# Altium schematic sheet MOSFET.SchDoc
size A4; SheetNumber: 5; SheetTotal: 7
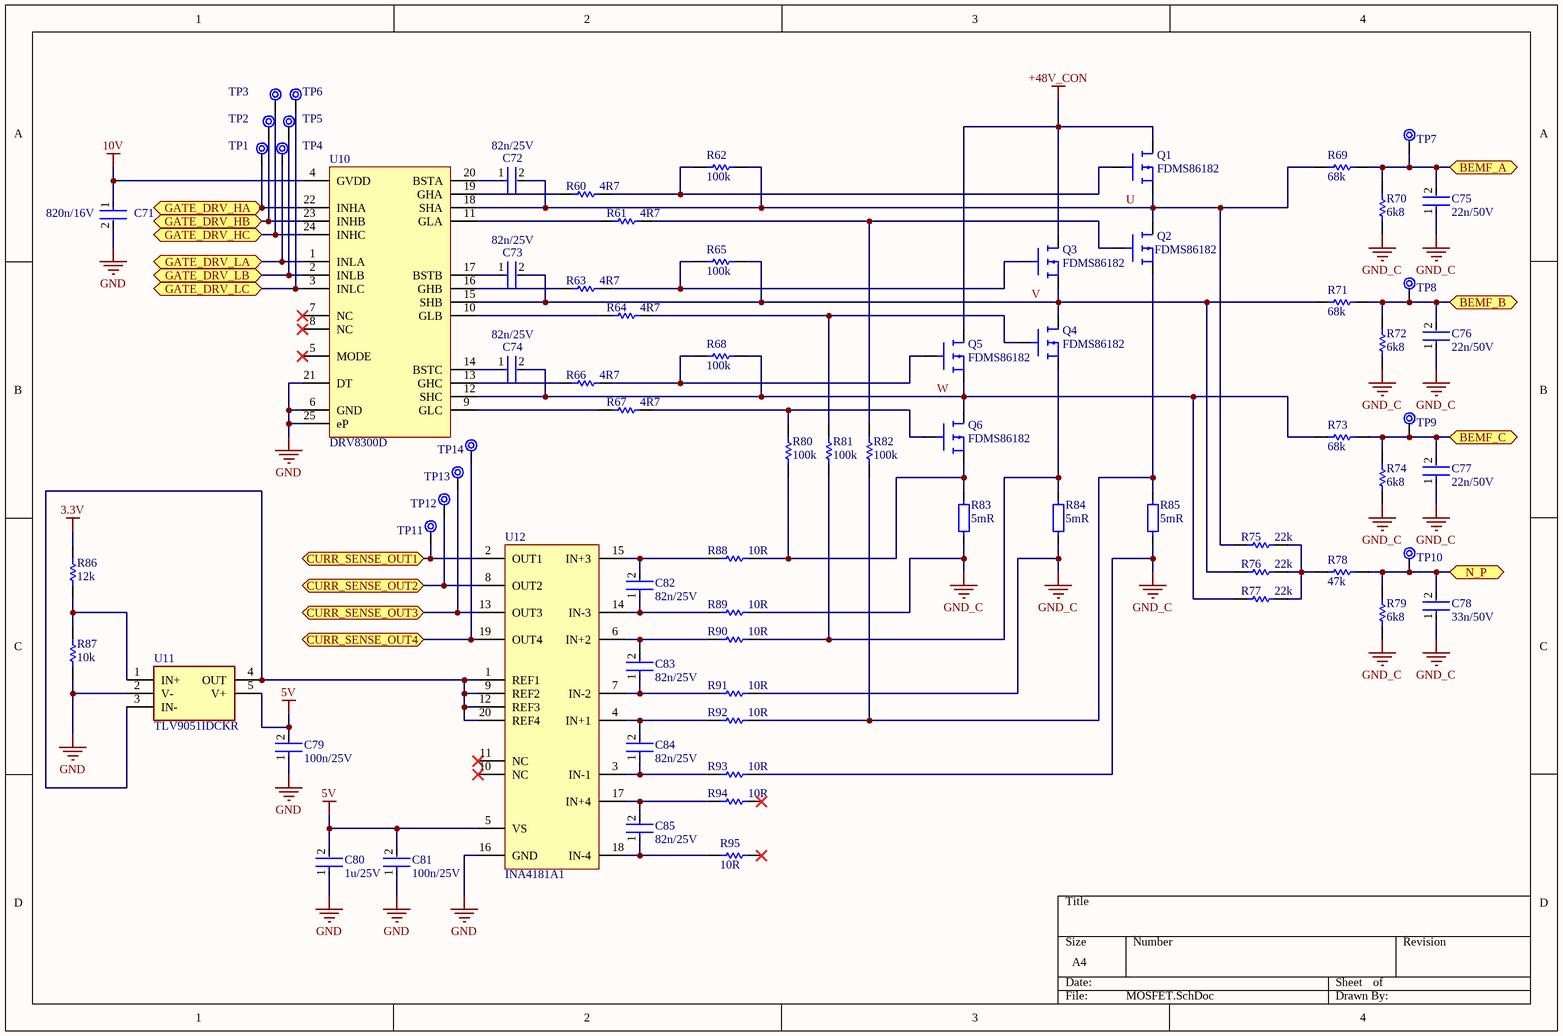
[diagram p0: MOSFET.SchDoc]

## Parts
C71  820n/16V  [FP-C0805C-DN-MFG]
C72  82n/25V  [FP-C0805C-DN-MFG]
C73  82n/25V  [FP-C0805C-DN-MFG]
C74  82n/25V  [FP-C0805C-DN-MFG]
C75  22n/50V  [FP-C0805C-DN-MFG]
C76  22n/50V  [FP-C0805C-DN-MFG]
C77  22n/50V  [FP-C0805C-DN-MFG]
C78  33n/50V  [FP-C0805C-DN-MFG]
C79  100n/25V  [FP-C0805C-DN-MFG]
C80  1u/25V  [FP-C0805C-DN-MFG]
C81  100n/25V  [FP-C0805C-DN-MFG]
C82  82n/25V  [FP-C0805C-DN-MFG]
C83  82n/25V  [FP-C0805C-DN-MFG]
C84  82n/25V  [FP-C0805C-DN-MFG]
C85  82n/25V  [FP-C0805C-DN-MFG]
Q1  FDMS86182  [FDMS86182]
Q2  FDMS86182  [FDMS86182]
Q3  FDMS86182  [FDMS86182]
Q4  FDMS86182  [FDMS86182]
Q5  FDMS86182  [FDMS86182]
Q6  FDMS86182  [FDMS86182]
R60  4R7  [RESC2013X50X30LL20T20]
R61  4R7  [RESC2013X50X30LL20T20]
R62  100k  [RESC2013X50X30LL20T20]
R63  4R7  [RESC2013X50X30LL20T20]
R64  4R7  [RESC2013X50X30LL20T20]
R65  100k  [RESC2013X50X30LL20T20]
R66  4R7  [RESC2013X50X30LL20T20]
R67  4R7  [RESC2013X50X30LL20T20]
R68  100k  [RESC2013X50X30LL20T20]
R69  68k  [RESC2013X50X30LL20T20]
R70  6k8  [RESC2013X50X30LL20T20]
R71  68k  [RESC2013X50X30LL20T20]
R72  6k8  [RESC2013X50X30LL20T20]
R73  68k  [RESC2013X50X30LL20T20]
R74  6k8  [RESC2013X50X30LL20T20]
R75  22k  [RESC2013X50X30LL20T20]
R76  22k  [RESC2013X50X30LL20T20]
R77  22k  [RESC2013X50X30LL20T20]
R78  47k  [RESC2013X50X30LL20T20]
R79  6k8  [RESC2013X50X30LL20T20]
R80  100k  [RESC2013X50X30LL20T20]
R81  100k  [RESC2013X50X30LL20T20]
R82  100k  [RESC2013X50X30LL20T20]
R83  value 5mR  [RESC6432X08N]  (hidden comment: 5mR/2512)
R84  value 5mR  [RESC6432X08N]  (hidden comment: 5mR/2512)
R85  value 5mR  [RESC6432X08N]  (hidden comment: 5mR/2512)
R86  12k  [RESC2013X50X30LL20T20]
R87  10k  [RESC2013X50X30LL20T20]
R88  10R  [RESC2013X50X30LL20T20]
R89  10R  [RESC2013X50X30LL20T20]
R90  10R  [RESC2013X50X30LL20T20]
R91  10R  [RESC2013X50X30LL20T20]
R92  10R  [RESC2013X50X30LL20T20]
R93  10R  [RESC2013X50X30LL20T20]
R94  10R  [RESC2013X50X30LL20T20]
R95  10R  [RESC2013X50X30LL20T20]
TP1  Test Point 1mm  [Pad 1mm]  (value not drawn)
TP2  Test Point 1mm  [Pad 1mm]  (value not drawn)
TP3  Test Point 1mm  [Pad 1mm]  (value not drawn)
TP4  Test Point 1mm  [Pad 1mm]  (value not drawn)
TP5  Test Point 1mm  [Pad 1mm]  (value not drawn)
TP6  Test Point 1mm  [Pad 1mm]  (value not drawn)
TP7  Test Point 1mm  [Pad 1mm]  (value not drawn)
TP8  Test Point 1mm  [Pad 1mm]  (value not drawn)
TP9  Test Point 1mm  [Pad 1mm]  (value not drawn)
TP10  Test Point 1mm  [Pad 1mm]  (value not drawn)
TP11  Test Point 1mm  [Pad 1mm]  (value not drawn)
TP12  Test Point 1mm  [Pad 1mm]  (value not drawn)
TP13  Test Point 1mm  [Pad 1mm]  (value not drawn)
TP14  Test Point 1mm  [Pad 1mm]  (value not drawn)
U10  DRV8300D  [PQFN50P400X400X100_HS-25N]
U11  TLV9051IDCKR  [SOT65P210X110-5N]
U12  INA4181A1  [TSOP65P640X120-20N]

## Ports
BEMF_A (bidir, see MCU[7A]), BEMF_B (bidir, see MCU[7A]), BEMF_C (bidir, see MCU[7A]), CURR_SENSE_OUT1 (bidir, see MCU[7B]), CURR_SENSE_OUT2 (bidir, see MCU[7B]), CURR_SENSE_OUT3 (bidir, see MCU[7A]), CURR_SENSE_OUT4 (bidir, see MCU[7A]), GATE_DRV_HA (bidir, see MCU[5A]), GATE_DRV_HB (bidir, see MCU[5A]), GATE_DRV_HC (bidir, see MCU[5A]), GATE_DRV_LA (bidir, see MCU[5A]), GATE_DRV_LB (bidir, see MCU[5A]), GATE_DRV_LC (bidir, see MCU[5A]), N_P (bidir, see MCU[7B])

## Nets
3.3V: R86.1
5V: C79.2 C80.2 C81.2 U11.5(V+) U12.5(VS)
10V: C71.1 U10.4(GVDD)
+48V_CON: Q1.D Q3.D Q5.D
GND: C71.2 C79.1 C80.1 C81.1 R87.2 U10.6(GND) U10.21(DT) U10.25(eP) U11.2(V-) U12.16(GND)
GND_C: C75.1 C76.1 C77.1 C78.1 R70.2 R72.2 R74.2 R79.2 R83.1 R84.1 R85.1 R89.1 R91.1 R93.1
BEMF_A: C75.2 R69.1 R70.1 TP7.1 ; port BEMF_A
BEMF_B: C76.2 R71.1 R72.1 TP8.1 ; port BEMF_B
BEMF_C: C77.2 R73.1 R74.1 TP9.1 ; port BEMF_C
CURR_SENSE_OUT1: TP11.1 U12.2(OUT1) ; port CURR_SENSE_OUT1
CURR_SENSE_OUT2: TP12.1 U12.8(OUT2) ; port CURR_SENSE_OUT2
CURR_SENSE_OUT3: TP13.1 U12.13(OUT3) ; port CURR_SENSE_OUT3
CURR_SENSE_OUT4: TP14.1 U12.19(OUT4) ; port CURR_SENSE_OUT4
GATE_DRV_HA: TP1.1 U10.22(INHA) ; port GATE_DRV_HA
GATE_DRV_HB: TP2.1 U10.23(INHB) ; port GATE_DRV_HB
GATE_DRV_HC: TP3.1 U10.24(INHC) ; port GATE_DRV_HC
GATE_DRV_LA: TP4.1 U10.1(INLA) ; port GATE_DRV_LA
GATE_DRV_LB: TP5.1 U10.2(INLB) ; port GATE_DRV_LB
GATE_DRV_LC: TP6.1 U10.3(INLC) ; port GATE_DRV_LC
N_P: C78.2 R78.1 R79.1 TP10.1 ; port N_P
U: C72.2 Q1.S Q2.D R62.1 R69.2 R75.2 U10.18(SHA)
V: C73.2 Q3.S Q4.D R65.1 R71.2 R76.2 U10.15(SHB)
W: C74.2 Q5.S Q6.D R68.1 R73.2 R77.2 U10.12(SHC)
NetC72_1: C72.1 U10.20(BSTA)
NetC73_1: C73.1 U10.17(BSTB)
NetC74_1: C74.1 U10.14(BSTC)
NetC82_1: C82.1 R89.2 U12.14(IN-3)
NetC82_2: C82.2 R88.2 U12.15(IN+3)
NetC83_1: C83.1 R91.2 U12.7(IN-2)
NetC83_2: C83.2 R90.2 U12.6(IN+2)
NetC84_1: C84.1 R93.2 U12.3(IN-1)
NetC84_2: C84.2 R92.2 U12.4(IN+1)
NetC85_1: C85.1 R95.2 U12.18(IN-4)
NetC85_2: C85.2 R94.2 U12.17(IN+4)
NetQ1_G: Q1.G R60.1 R62.2
NetQ2_G: Q2.G R61.1 R82.1
NetQ2_S: Q2.S R82.2 R85.2 R92.1
NetQ3_G: Q3.G R63.1 R65.2
NetQ4_G: Q4.G R64.1 R81.1
NetQ4_S: Q4.S R81.2 R84.2 R90.1
NetQ5_G: Q5.G R66.1 R68.2
NetQ6_G: Q6.G R67.1 R80.1
NetQ6_S: Q6.S R80.2 R83.2 R88.1
NetR60_2: R60.2 U10.19(GHA)
NetR61_2: R61.2 U10.11(GLA)
NetR63_2: R63.2 U10.16(GHB)
NetR64_2: R64.2 U10.10(GLB)
NetR66_2: R66.2 U10.13(GHC)
NetR67_2: R67.2 U10.9(GLC)
NetR75_1: R75.1 R76.1 R77.1 R78.2
NetR86_2: R86.2 R87.1 U11.1(IN+)
NetU11_3: U11.3(IN-) U11.4(OUT) U12.1(REF1) U12.9(REF2) U12.12(REF3) U12.20(REF4)

Not connected (* = marked no-connect by the designer): R94 1*; R95 1*; U10 5(MODE)* 7(NC)* 8(NC)*; U12 10(NC)* 11(NC)*

## Library data of the parts
C71-C85 = CMP-2007-00279-2: CAP CER 0.1UF 50V X7R 0805; Manufacturer Part Number: C0805C104K5RACTU; Manufacturer: KEMET; Value: 0.10 μF; Tolerance: 0.1; Temperature Coefficient: 30ppm/°C; Material: Ceramic; Device Class L2: Capacitors; Temperature Range Low: -55°C; Voltage Rating: 50 V; Digikey Description: CAP CER 0.1UF 50V X7R 0805; Category: Cap; ComponentLink2Description: Datasheet; Octopart: https://octopart.com/c0805c104k5ractu-kemet-143926; RoHS: TRUE; ComponentLink2URL: https://content.kemet.com/datasheets/KEM_C1003_C0G_SMD.pdf; Temperature Characteristic: X7R; Temperature: -55°C to +125°C; Height: 0.88mm; Temperature Range High: +125°C; Device Class L1: Passive Components; Automotive: No; Lead Free: Yes; Ipc Land Pattern Name: CAPC200125X78; Device Class L3: Ceramic Capacitors; Mouser Description: Cap Ceramic 0.1uF 50V X7R 10% SMD 2.0 x 1.2 mm 125 C Paper T/R; Capacitance: 0.10 μF; Package: C0805C-DN
Q1-Q6 = FDMS86182: MOSFET PTNG 100/20V Nch Power Trench MOSFET; Manufacturer: Onsemi; Distributor 1: Mouser; Distributor 1 ID: 512-FDMS86182; Part Number: FDMS86182; Second Source: *; ComponentLink1Description: Datasheet; ComponentLink1URL: https://www.mouser.pl/datasheet/2/308/1/FDMS86182_D-2312683.pdf; ComponentLink2Description: Distributor 1; ComponentLink2URL: https://www.mouser.pl/ProductDetail/onsemi-Fairchild/FDMS86182?qs=V471yVjZJ9utOAPYzzuTZA%3D%3D
R60-R82 R86-R95 = CMP-2001-04896-1: 0805; Manufacturer: Vishay Dale; Part Number: CRCW08050000Z0EA
R83-R85 = RES/5mR/1%/2512: Current Sense Resistors - SMD 0.005ohms 1% 75PPM; Manufacturer: Vishay; Part Number: CRCW0402100RFKEDC; Distributor: Mouser; Distributor ID: 71-CRCW0402100RFKEDC
U10 = DRV8300D: Gate Drivers 100-V max simple 3-phase gate driver with bootstrap diodes 24-VQFN -40 to 125; Manufacturer: Texas Instruments; Part Number: DRV8300DRGER; Distributor: Mouser; Distributor ID: 595-DRV8300DRGER
U11 = TLV9051IDCKR: Operational Amplifiers - Op Amps OPAMP; Manufacturer_Name: Texas Instruments; Geometry.Height: 1.1mm; Mouser Part Number: 595-TLV9051IDCKR; Mouser Price/Stock: https://www.mouser.co.uk/ProductDetail/Texas-Instruments/TLV9051IDCKR?qs=T3oQrply3y8HFppUE%252BGx7w%3D%3D; Manufacturer_Part_Number: TLV9051IDCKR; Datasheet Link: https://www.ti.com/lit/gpn/TLV9051
U12 = INA4181A1: Current Sense Amplifiers 26V, quad channel, bi-directional, 350kHz current sense amplifier 20-TSSOP -40 to 125; Manufacturer: Texas Instruments; Part Number: INA4181A1IPWR; Distributor: Mouser; Distributor ID: 595-INA4181A1IPWR